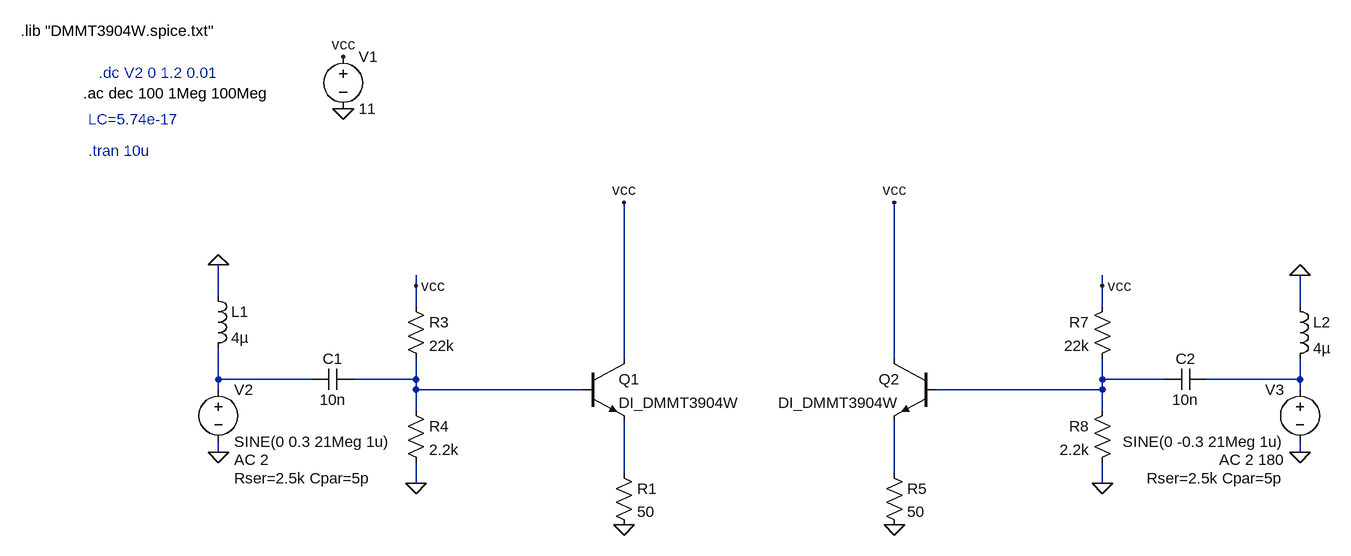
[diagram p0: schematic Follower.asc]
Follower.asc, the LTspice schematic file:
Version 4.1
SHEET 1 4292 2340
WIRE -128 -16 -128 -32
WIRE 928 -16 928 -32
WIRE -432 0 -432 -48
WIRE -128 16 -128 -16
WIRE 928 16 928 -16
WIRE 1232 16 1232 -32
WIRE 192 96 192 -144
WIRE 608 96 608 -144
WIRE -432 128 -432 80
WIRE -288 128 -432 128
WIRE -128 128 -128 96
WIRE -128 128 -224 128
WIRE 928 128 928 96
WIRE 1024 128 928 128
WIRE 1232 128 1232 96
WIRE 1232 128 1088 128
WIRE -432 144 -432 128
WIRE -128 144 -128 128
WIRE 128 144 -128 144
WIRE 928 144 928 128
WIRE 928 144 672 144
WIRE 1232 144 1232 128
WIRE -128 176 -128 144
WIRE 928 176 928 144
WIRE -432 240 -432 224
WIRE 1232 240 1232 224
WIRE 192 272 192 192
WIRE 608 272 608 192
WIRE -128 288 -128 256
WIRE 928 288 928 256
FLAG -240 -288 0
FLAG -432 240 0
FLAG -240 -368 vcc
FLAG -128 288 0
FLAG -128 -16 vcc
FLAG 192 -144 vcc
FLAG 1232 240 0
FLAG 928 288 0
FLAG 928 -16 vcc
FLAG 608 -144 vcc
FLAG 192 352 0
FLAG 608 352 0
FLAG -432 -48 0
FLAG 1232 -32 0
SYMBOL npn 128 96 R0
SYMATTR InstName Q1
SYMATTR Value DI_DMMT3904W
SYMBOL voltage -240 -384 R0
WINDOW 123 0 0 Left 0
WINDOW 39 0 0 Left 0
SYMATTR InstName V1
SYMATTR Value 11
SYMBOL voltage -432 128 R0
WINDOW 123 24 124 Left 2
WINDOW 39 24 152 Left 2
SYMATTR Value2 AC 2
SYMATTR SpiceLine Rser=2.5k Cpar=5p
SYMATTR InstName V2
SYMATTR Value SINE(0 0.3 21Meg 1u)
SYMBOL cap -224 112 R90
WINDOW 0 0 32 VBottom 2
WINDOW 3 32 32 VTop 2
SYMATTR InstName C1
SYMATTR Value 10n
SYMBOL res -144 0 R0
SYMATTR InstName R3
SYMATTR Value 22k
SYMBOL res -144 160 R0
SYMATTR InstName R4
SYMATTR Value 2.2k
SYMBOL npn 672 96 M0
SYMATTR InstName Q2
SYMATTR Value DI_DMMT3904W
SYMBOL voltage 1232 128 M0
WINDOW 123 24 124 Left 2
WINDOW 39 24 152 Left 2
SYMATTR Value2 AC 2 180
SYMATTR SpiceLine Rser=2.5k Cpar=5p
SYMATTR InstName V3
SYMATTR Value SINE(0 -0.3 21Meg 1u)
SYMBOL cap 1024 112 M90
WINDOW 0 0 32 VBottom 2
WINDOW 3 32 32 VTop 2
SYMATTR InstName C2
SYMATTR Value 10n
SYMBOL res 944 0 M0
SYMATTR InstName R7
SYMATTR Value 22k
SYMBOL res 944 160 M0
SYMATTR InstName R8
SYMATTR Value 2.2k
SYMBOL res 176 256 R0
SYMATTR InstName R1
SYMATTR Value 50
SYMBOL res 592 256 R0
SYMATTR InstName R5
SYMATTR Value 50
SYMBOL ind -448 -16 R0
SYMATTR InstName L1
SYMATTR Value 4µ
SYMATTR SpiceLine Rser=1m
SYMBOL ind 1216 0 R0
SYMATTR InstName L2
SYMATTR Value 4µ
SYMATTR SpiceLine Rser=1m
TEXT -736 -408 Left 2 !.lib "DMMT3904W.spice.txt"
TEXT -616 -344 Left 2 ;.dc V2 0 1.2 0.01
TEXT -640 -312 Left 2 !.ac dec 100 1Meg 100Meg
TEXT -632 -272 Left 2 ;LC=5.74e-17
TEXT -632 -224 Left 2 ;.tran 10u

The netlist it stands for:
* Follower.asc
Q1 vcc N002 N005 0 DI_DMMT3904W
V1 vcc 0 11
V2 N001 0 SINE(0 0.3 21Meg 1u) AC 2 Rser=2.5k Cpar=5p
C1 N002 N001 10n
R3 vcc N002 22k
R4 N002 0 2.2k
Q2 vcc N003 N006 0 DI_DMMT3904W
V3 N004 0 SINE(0 -0.3 21Meg 1u) AC 2 180 Rser=2.5k Cpar=5p
C2 N003 N004 10n
R7 vcc N003 22k
R8 N003 0 2.2k
R1 N005 0 50
R5 N006 0 50
L1 0 N001 4µ Rser=1m
L2 0 N004 4µ Rser=1m
.model NPN NPN
.model PNP PNP
.lib standard.bjt
.lib "DMMT3904W.spice.txt"
* .dc V2 0 1.2 0.01
.ac dec 100 1Meg 100Meg
* LC=5.74e-17
* .tran 10u
.backanno
.end